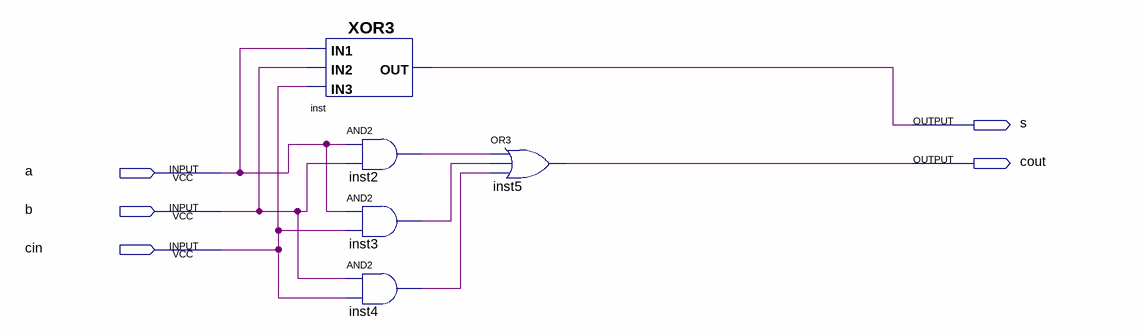
[diagram p0: schematic sheet]
// Quartus schematic FullAdder.bdf as structural Verilog: 5 symbols, 5 pins
module FullAdder (
  input  a,
  input  b,
  input  cin,
  output s,
  output cout
);

  wire inst2_out, inst3_out, inst4_out;

  XOR3 inst (.IN3(cin), .IN1(a), .IN2(b), .OUT(s));
  and inst2 (inst2_out, a, b);
  and inst3 (inst3_out, a, cin);
  and inst4 (inst4_out, b, cin);
  or inst5 (cout, inst2_out, inst3_out, inst4_out);
endmodule
